# EAGLE design Smedby Charger prot (EAGLE 6.5.0)
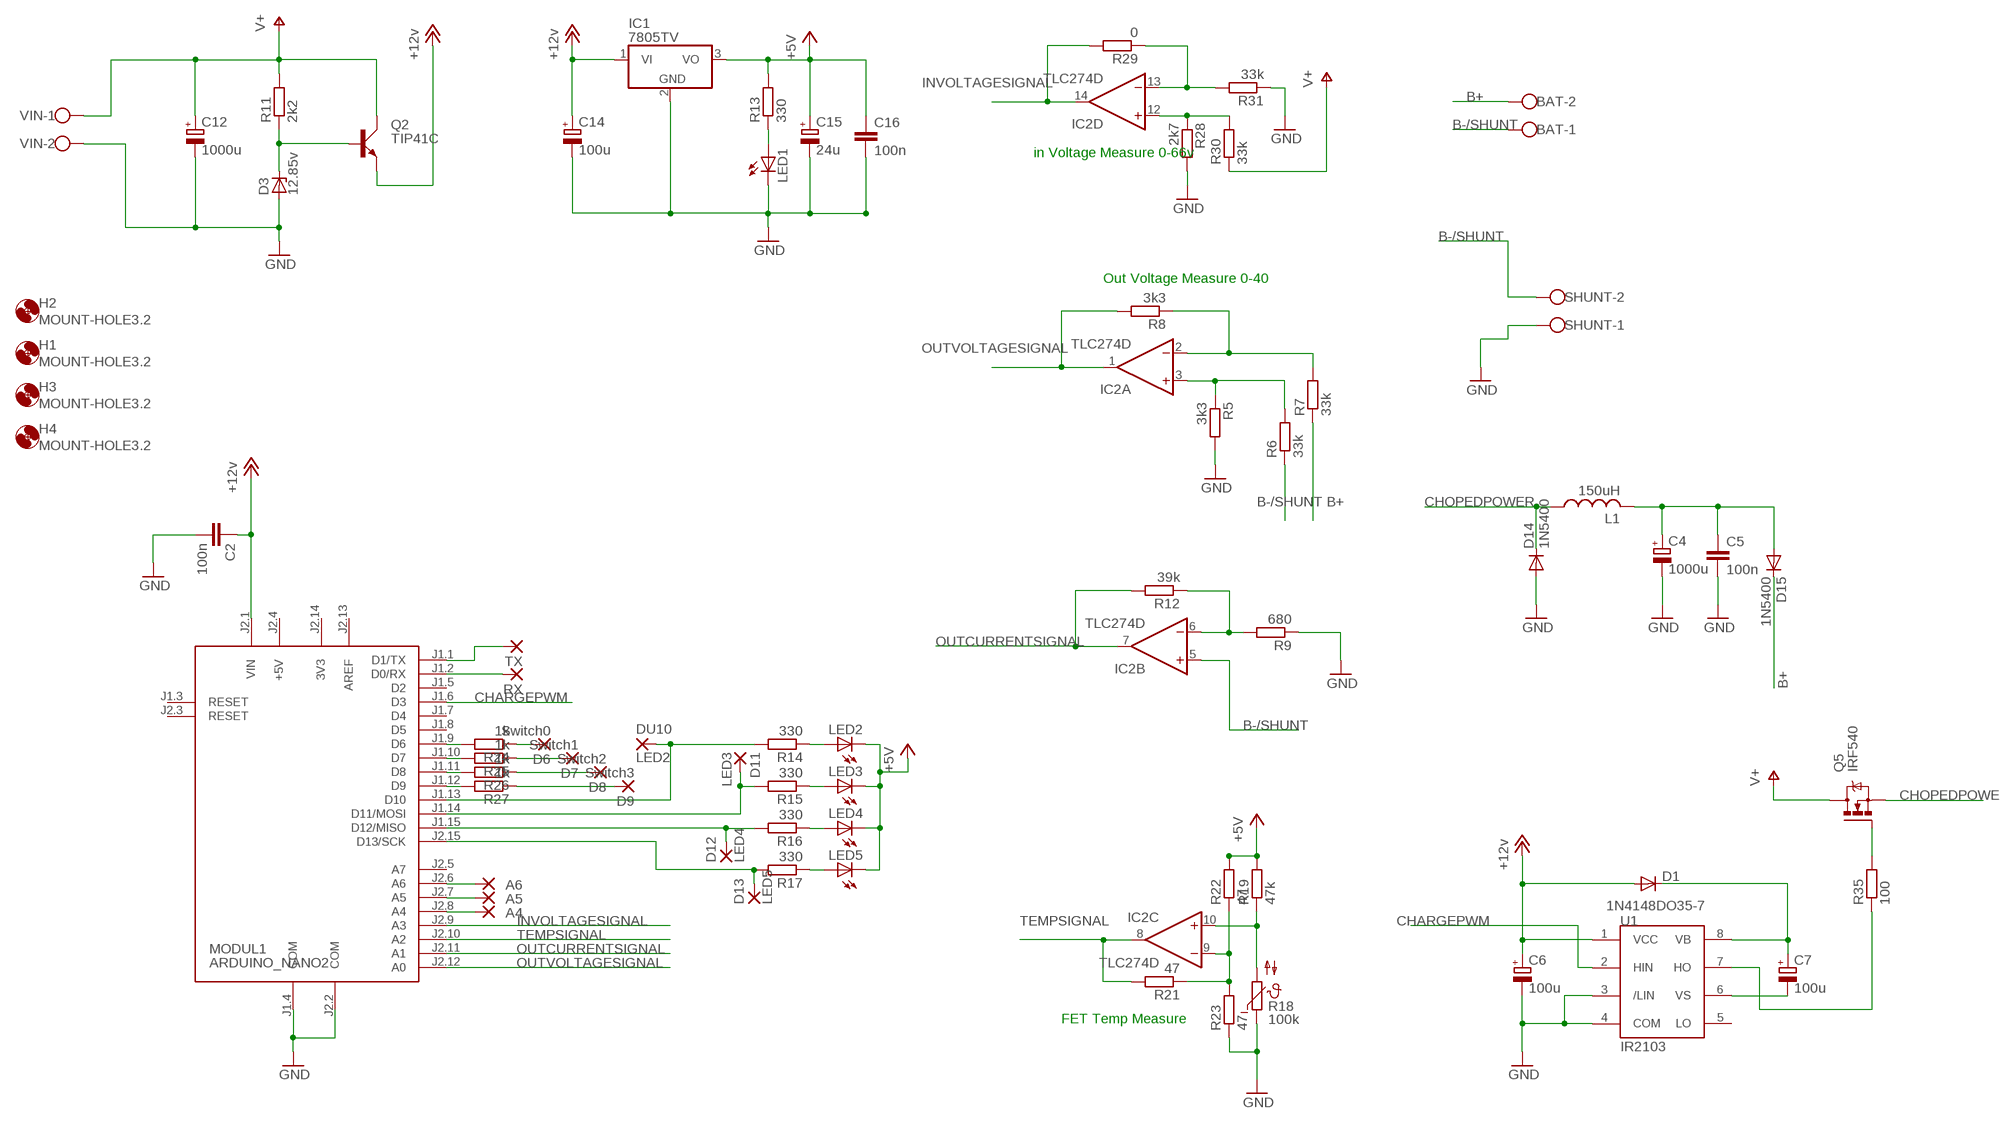
[diagram p0: schematic, sheet 1]

## Parts
A4  1,6/0,9  [1,6/0,9]
A5  1,6/0,9  [1,6/0,9]
A6  1,6/0,9  [1,6/0,9]
BAT  W237-102  [W237-102]
C2  100n  C-EU050-024X044  [C050-024X044]
C4  1000u  CPOL-EUE7.5-18  [E7,5-18]
C5  100n  C-EU050-024X044  [C050-024X044]
C6  100u  CPOL-EUE2.5-5  [E2,5-5]
C7  100u  CPOL-EUE2.5-5  [E2,5-5]
C12  1000u  CPOL-EUE7.5-18  [E7,5-18]
C14  100u  CPOL-EUE2.5-5  [E2,5-5]
C15  24u  CPOL-EUE2.5-5  [E2,5-5]
C16  100n  C-EU050-024X044  [C050-024X044]
D1  1N4148DO35-7  [DO35-7]
D3  12.85v  BZX55  [DO35Z10]
D6  Switch0  1,6/0,9  [1,6/0,9]
D7  Switch1  1,6/0,9  [1,6/0,9]
D8  Switch2  1,6/0,9  [1,6/0,9]
D9  Switch3  1,6/0,9  [1,6/0,9]
D11  LED3  1,6/0,9  [1,6/0,9]
D12  LED4  1,6/0,9  [1,6/0,9]
D13  LED5  1,6/0,9  [1,6/0,9]
D14  1N5400  [DO201-15]
D15  1N5400  [DO201-15]
DU10  LED2  1,6/0,9  [1,6/0,9]
H1  MOUNT-HOLE3.2  [3,2]
H2  MOUNT-HOLE3.2  [3,2]
H3  MOUNT-HOLE3.2  [3,2]
H4  MOUNT-HOLE3.2  [3,2]
IC1  7805TV  [TO220V]
IC2  TLC274D  [SO14]
L1  150uH  L-USTJ4-U1  [TJ4-U1]
LED1  LED3MM  [LED3MM]
LED2  LED3MM  [LED3MM]
LED3  LED3MM  [LED3MM]
LED4  LED3MM  [LED3MM]
LED5  LED3MM  [LED3MM]
MODUL1  ARDUINO_NANO2  [ARDUINO_NANO2]
Q2  TIP41C  [TO220AV]
Q5  IRF540  [TO220BV]
R5  3k3  R-EU_0207/2V  [0207/2V]
R6  33k  R-EU_0207/2V  [0207/2V]
R7  33k  R-EU_0207/2V  [0207/2V]
R8  3k3  R-EU_0207/2V  [0207/2V]
R9  680  R-EU_0207/2V  [0207/2V]
R11  2k2  R-EU_0617/5V  [0617V]
R12  39k  R-EU_0207/2V  [0207/2V]
R13  330  R-EU_0207/2V  [0207/2V]
R14  330  R-EU_0207/2V  [0207/2V]
R15  330  R-EU_0207/2V  [0207/2V]
R16  330  R-EU_0207/2V  [0207/2V]
R17  330  R-EU_0207/2V  [0207/2V]
R18  100k  NTC640-9  [N640]
R19  47k  R-EU_0207/2V  [0207/2V]
R21  47  R-EU_0207/2V  [0207/2V]
R22  47  R-EU_0207/2V  [0207/2V]
R23  47  R-EU_0207/2V  [0207/2V]
R24  1k  R-EU_0207/2V  [0207/2V]
R25  1k  R-EU_0207/2V  [0207/2V]
R26  1k  R-EU_0207/2V  [0207/2V]
R27  1k  R-EU_0207/2V  [0207/2V]
R28  2k7  R-EU_0207/2V  [0207/2V]
R29  0  R-EU_0207/2V  [0207/2V]
R30  33k  R-EU_0207/2V  [0207/2V]
R31  33k  R-EU_0207/2V  [0207/2V]
R35  100  R-EU_0207/2V  [0207/2V]
RX  1,6/0,9  [1,6/0,9]
SHUNT  W237-102  [W237-102]
TX  1,6/0,9  [1,6/0,9]
U1  IR2103  [DIL08]
VIN  W237-102  [W237-102]

## Nets
+5V [Power]: C15.+ C16.1 IC1.3(VO) LED2.K(C) LED3.K(C) LED4.K(C) LED5.K(C) R13.2 R19.2 R22.2
+12V [Power]: C2.1 C6.+ C14.+ D1.A IC1.1(VI) MODUL1.J2.1(VIN) Q2.E U1.1(VCC) ; supply symbol labelled +12v
B+ [HighPower]: BAT.2 D15.C R7.1
B-/SHUNT [HighPower]: BAT.1 IC2.5(B:+IN) R6.1 SHUNT.2
CHARGEPWM: MODUL1.J1.6(D3) U1.2(HIN)
CHOPEDPOWER [HighPower]: D14.C L1.1 Q5.S
GND [HighPower]: C2.2 C4.- C5.2 C6.- C12.- C14.- C15.- C16.2 D3.A D14.A IC1.2(GND) LED1.K(C) MODUL1.J1.4(COM) MODUL1.J2.2(COM) R5.2 R9.1 R18.1 R23.1 R28.2 R31.1 SHUNT.1 U1.3(/LIN) U1.4(COM) VIN.2
INVOLTAGESIGNAL: IC2.14(D:OUT) MODUL1.J2.9(A3) R29.2
LED2: DU10.1(P) MODUL1.J1.13(D10) R14.2
LED3: D11.1(P) MODUL1.J1.14(D11/MOSI) R15.2
LED4: D12.1(P) MODUL1.J1.15(D12/MISO) R16.2
LED5: D13.1(P) MODUL1.J2.15(D13/SCK) R17.2
N$1: D3.C Q2.B R11.1
N$2 [Power]: C7.- U1.6(VS)
N$3: IC2.12(D:+IN) R28.1 R30.2
N$4 [Power]: Q5.G R35.2
N$5: A4.1(P) MODUL1.J2.8(A4)
N$6: MODUL1.J1.1(D1/TX) TX.1(P)
N$8: MODUL1.J1.9(D6) R24.2
N$11: IC2.6(B:-IN) R9.2 R12.1
N$12: MODUL1.J1.10(D7) R25.2
N$14: MODUL1.J1.11(D8) R26.2
N$15: MODUL1.J1.12(D9) R27.2
N$16: A5.1(P) MODUL1.J2.7(A5)
N$17: A6.1(P) MODUL1.J2.6(A6)
N$18: MODUL1.J1.2(D0/RX) RX.1(P)
N$20 [Power]: R35.1 U1.7(HO)
N$22 [HighPower]: C4.+ C5.1 D15.A L1.2
N$24: IC2.3(A:+IN) R5.1 R6.2
N$27: IC2.2(A:-IN) R7.2 R8.1
N$29: LED1.A R13.1
N$30: LED2.A R14.1
N$31: LED3.A R15.1
N$34: LED4.A R16.1
N$35: LED5.A R17.1
N$39: IC2.9(C:-IN) R21.1 R22.1 R23.2
N$46: IC2.10(C:+IN) R18.2 R19.1
N$48: IC2.13(D:-IN) R29.1 R31.2
N$54: D6.1(P) R24.1
N$55: D7.1(P) R25.1
N$56: D8.1(P) R26.1
N$57: D9.1(P) R27.1
OUTCURRENTSIGNAL: IC2.7(B:OUT) MODUL1.J2.11(A1) R12.2
OUTVOLTAGESIGNAL: IC2.1(A:OUT) MODUL1.J2.12(A0) R8.2
TEMPSIGNAL: IC2.8(C:OUT) MODUL1.J2.10(A2) R21.2
V+ [HighPower]: C12.+ Q2.C Q5.D R11.2 R30.1 VIN.1
VB [Power]: C7.+ D1.C U1.8(VB)
Unconnected: MODUL1.J1.3(RESET) MODUL1.J1.5(D2) MODUL1.J1.7(D4) MODUL1.J1.8(D5) MODUL1.J2.3(RESET) MODUL1.J2.5(A7) U1.5(LO)

## Notes on the sheet
- in Voltage Measure 0-66v
- Out Voltage Measure 0-40
- FET Temp Measure

## Power pins joined to a net without a drawn wire
3V3: MODUL1.J2.14(3V3)
+5V: MODUL1.J2.4(+5V)
AREF: MODUL1.J2.13(AREF)
V+: IC2.4(P:V+)
V-: IC2.11(P:V-)

## Library data of the parts
A4-A6 D6-D9 D11-D13 DU10 RX TX = wirepad:1,6/0,9: THROUGH-HOLE PAD
BAT SHUNT VIN = con-wago-500:W237-102: WAGO SCREW CLAMP; MPN: 237-102; OC_FARNELL: unknown; OC_NEWARK: 70K9898
C2 C5 C16 = rcl:C-EU: CAPACITOR, European symbol
C4 C6 C7 C12 C14 C15 = rcl:CPOL-EU: POLARIZED CAPACITOR, European symbol
D1 = diode:1N4148: DIODE high speed (Philips)
D3 = diode:BZX55: Z DIODE
D14 D15 = diode:1N5400: DIODE standard rectifier, 3 A, 50 V (Motorola)
H1-H4 = holes:MOUNT-HOLE: MOUNTING HOLE with drill center marker
IC1 = linear:78*: Positive VOLTAGE REGULATOR Source: http://cache.national.com/ds/LM/LM78L05.pdf http://www.fairchildsemi.com/ds/LM/LM7805.pdf
IC2 = linear:TLC274: OP AMP
L1 = rcl:L-US: INDUCTOR, American symbol
LED1-LED5 = led:LED: LED OSRAM: - CHIPLED LG R971, LG N971, LY N971, LG Q971, LY Q971, LO R971, LY R971 LH N974, LH R974 LS Q976, LO Q976, LY Q976 LO Q996 - Hyper CHIPLED LW Q18S LB Q993, LB Q99A, LB R99A - SideLED LS A670, LO A670, LY A670, LG A670, LP A670 LB A673, LV A673, LT A673, LW A673 LH A674 LY A675 LS A676, LA A676, LO A676, LY A676, LW A676 LS A679, LY A679, LG A679 - Hyper Micro SIDELED® LS Y876, LA Y876, LO Y876, LY Y876 LT Y87S - SmartLED LW L88C, LW L88S LB L89C, LB L89S, LG L890 LS L89K, LO L89K, LY L89K LS L896, LA L896, LO L896, LY L896 - TOPLED LS T670, LO T670, LY T670, LG T670, LP T670 LSG T670, LSP T670, LSY T670, LOP T670, LYG T670 LG T671, LOG T671, LSG T671 LB T673, LV T673, LT T673, LW T673 LH T674 LS T676, LA T676, LO T676, LY T676, LB T676, LH T676, LSB T676, LW T676 LB T67C, LV T67C, LT T67C, LS T67K, LO T67K, LY T67K, LW E67C LS E67B, LA E67B, LO E67B, LY E67B, LB E67C, LV E67C, LT E67C LW T67C LS T679, LY T679, LG T679 LS T770, LO T770, LY T770, LG T770, LP T770 LB T773, LV T773, LT T773, LW T773 LH T774 LS E675, LA E675, LY E675, LS T675 LS T776, LA T776, LO T776, LY T776, LB T776 LHGB T686 LT T68C, LB T68C - Hyper Mini TOPLED® LB M676 - Mini TOPLED Santana® LG M470 LS M47K, LO M47K, LY M47K Source: http://www.osram.convergy.de LUXEON: - LUMILED® LXK2-PW12-R00, LXK2-PW12-S00, LXK2-PW14-U00, LXK2-PW14-V00 LXK2-PM12-R00, LXK2-PM12-S00, LXK2-PM14-U00 LXK2-PE12-Q00, LXK2-PE12-R00, LXK2-PE12-S00, LXK2-PE14-T00, LXK2-PE14-U00 LXK2-PB12-K00, LXK2-PB12-L00, LXK2-PB12-M00, LXK2-PB14-N00, LXK2-PB14-P00, LXK2-PB14-Q00 LXK2-PR12-L00, LXK2-PR12-M00, LXK2-PR14-Q00, LXK2-PR14-R00 LXK2-PD12-Q00, LXK2-PD12-R00, LXK2-PD12-S00 LXK2-PH12-R00, LXK2-PH12-S00 LXK2-PL12-P00, LXK2-PL12-Q00, LXK2-PL12-R00 Source: www.luxeon.com KINGBRIGHT: KA-3528ASYC Source: www.kingbright.com
MODUL1 = arduino:ARDUINO_NANO2: Arduino Nano2 Auto generated by modulcreator.ulp \;; ANZAHL: 2; MODUL: TRUE; STECKX0: -76200; STECKX1: 76200; STECKY0: 177800; STECKY1: 177800
Q2 = transistor-power:TIP41C: NPN TRANSISTOR
Q5 = transistor-power:IRF540: HEXFET Power MOSFET
R5-R9 R12-R17 R19 R21-R31 R35 = rcl:R-EU_: RESISTOR, European symbol
R11 = resistor:R-EU_: RESISTOR, European symbol
R18 = ptc-ntc:NTC640-9: PHILIPS NTC
U1 = irf-2:IR2103: High and low side driver

## Net classes
1 Power: width 0.5 mm
2 HighPower: width 1 mm

## Board
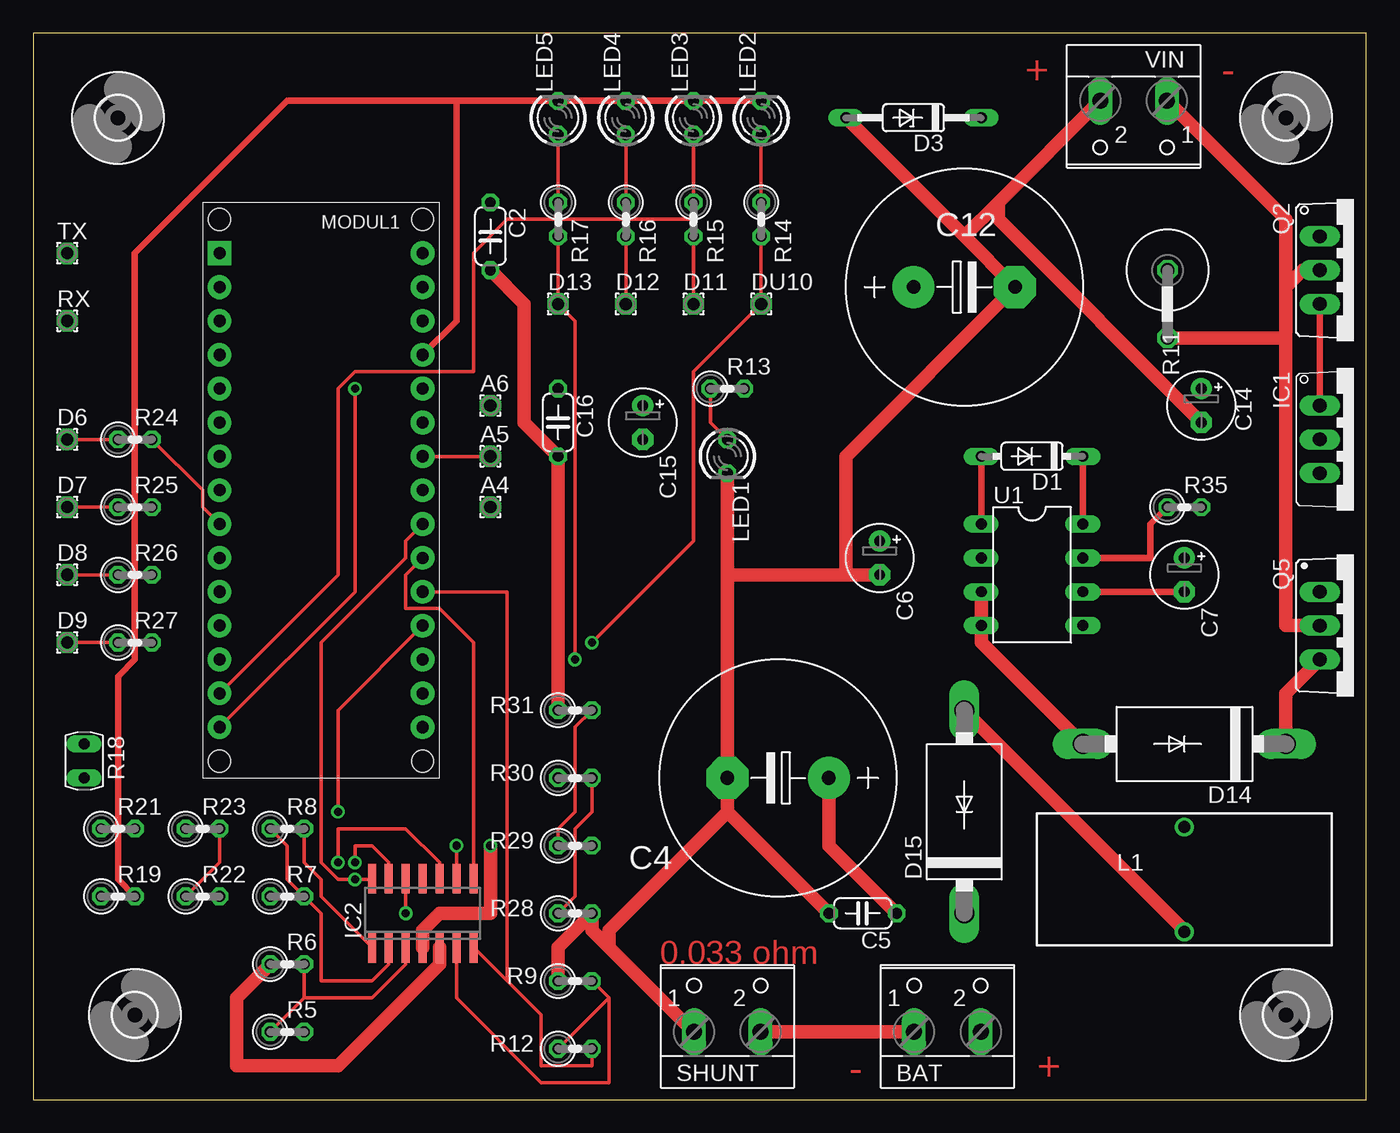
[diagram p1: board, top side]
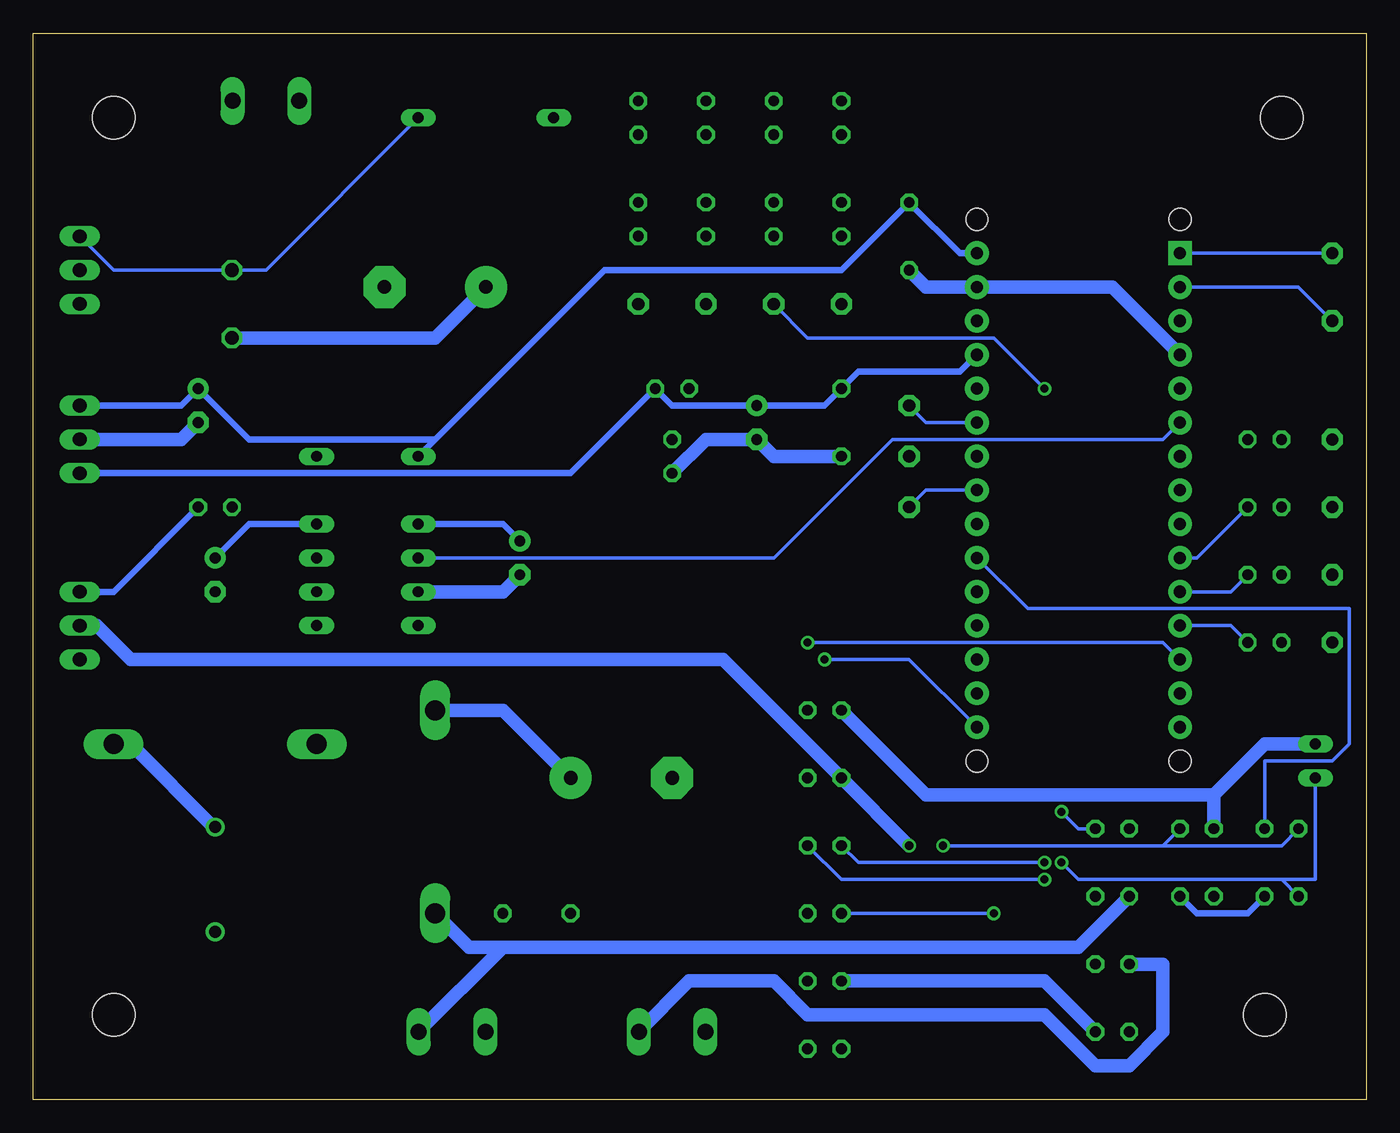
[diagram p2: board, bottom side, seen from below]

Size 100 x 80 mm. Coordinates in mm from the lower left corner, seen from the top.
Outline: 0,0 100,0 100,80 0,80 0,0
Copper layers (1*16): Top 0.035mm / dielectric 1.5mm / Bottom 0.035mm
Design rules "default": minimum track width 10mil, minimum drill 24mil, track to track 10mil, track to pad 10mil, pad to pad 10mil, via to via 10mil, smd to smd 10mil, copper to edge 40mil, drill to drill 10mil, minimum pad ring 10mil, minimum via ring 8mil, stop-mask expansion 0mil, vias tented up to drill 0mil, thermal gap 10mil

### Footprints (pad centres in the part's own frame; a part is rotated, then mirrored left to right if it is on the bottom)
1,6/0,9 = drill 0.914 pad 1.6 octagon: 1 0,0
W237-102 = drill 1.194 long: 1 -2.5,-1.27; 2 2.5,-1.27
C050-024X044 = drill 0.813 octagon: 1 -2.54,0; 2 2.54,0
E7,5-18 = drill 1.016 pad 3.15: + -3.81,0 | drill 1.016 pad 3.15 octagon: - 3.81,0
E2,5-5 = drill 0.813 pad 1.6: + -1.27,0 | drill 0.813 pad 1.6 octagon: - 1.27,0
DO35-7 = drill 0.813 long: A 3.81,0; C -3.81,0
DO35Z10 = drill 0.813 long: A 5.08,0; C -5.08,0
DO201-15 = drill 1.499 long: A 7.62,0; C -7.62,0
3,2 = hole 3.2: 0,0
TO220V = drill 1.016 long: 1 -2.54,-2.54; 2 0,-2.54; 3 2.54,-2.54
SO14 = smd 0.6 x 2.2: 1 -3.81,-2.6; 2 -2.54,-2.6; 3 -1.27,-2.6; 4 0,-2.6; 5 1.27,-2.6; 6 2.54,-2.6; 7 3.81,-2.6; 8 3.81,2.6; 9 2.54,2.6; 10 1.27,2.6; 11 0,2.6; 12 -1.27,2.6; 13 -2.54,2.6; 14 -3.81,2.6
TJ4-U1 = drill 0.9: 1 -3.935,0; 2 3.935,0
LED3MM = drill 0.813 octagon: A -1.27,0; K 1.27,0
ARDUINO_NANO2 = drill 0.914 pad 1.778 square: J1.1 -7.62,17.78 | drill 0.914 pad 1.778: J1.2 -7.62,15.24; J1.3 -7.62,12.7; J1.4 -7.62,10.16; J1.5 -7.62,7.62; J1.6 -7.62,5.08; J1.7 -7.62,2.54; J1.8 -7.62,0; J1.9 -7.62,-2.54; J1.10 -7.62,-5.08; J1.11 -7.62,-7.62; J1.12 -7.62,-10.16; J1.13 -7.62,-12.7; J1.14 -7.62,-15.24; J1.15 -7.62,-17.78; J2.1 7.62,17.78; J2.2 7.62,15.24; J2.3 7.62,12.7; J2.4 7.62,10.16; J2.5 7.62,7.62; J2.6 7.62,5.08; J2.7 7.62,2.54; J2.8 7.62,0; J2.9 7.62,-2.54; J2.10 7.62,-5.08; J2.11 7.62,-7.62; J2.12 7.62,-10.16; J2.13 7.62,-12.7; J2.14 7.62,-15.24; J2.15 7.62,-17.78 | hole 1.651: -7.62,-20.32; 7.62,-20.32; 7.62,20.32; -7.62,20.32
TO220AV = drill 1.016 long: B -2.54,-2.54; C 0,-2.54; E 2.54,-2.54
TO220BV = drill 1.016 long: D 0,-2.54; G -2.54,-2.54; S 2.54,-2.54
0207/2V = drill 0.813 octagon: 1 -1.27,0; 2 1.27,0
0617V = drill 1.016 octagon: 1 -2.54,0; 2 2.54,0
N640 = drill 0.813 long: 1 -1.27,0; 2 1.27,0
DIL08 = drill 0.813 long: 1 -3.81,-3.81; 2 -1.27,-3.81; 3 1.27,-3.81; 4 3.81,-3.81; 5 3.81,3.81; 6 1.27,3.81; 7 -1.27,3.81; 8 -3.81,3.81

### Placement (x,y rotation side)
A4  34.29,44.45 0 top
A5  34.29,48.26 0 top
A6  34.29,52.07 0 top
BAT  68.58,6.35 0 top
C2  34.29,64.77 270 top
C4  55.88,24.13 180 top
C5  62.23,13.97 180 top
C6  63.5,40.64 270 top
C7  86.36,39.37 270 top
C12  69.85,60.96 0 top
C14  87.63,52.07 270 top
C15  45.72,50.8 270 top
C16  39.37,50.8 270 top
D1  74.93,48.26 180 top
D3  66.04,73.66 180 top
D6  2.54,49.53 0 top
D7  2.54,44.45 0 top
D8  2.54,39.37 0 top
D9  2.54,34.29 0 top
D11  49.53,59.69 0 top
D12  44.45,59.69 0 top
D13  39.37,59.69 0 top
D14  86.36,26.67 180 top
D15  69.85,21.59 90 top
DU10  54.61,59.69 0 top
H1  6.35,73.66 0 top
H2  93.98,73.66 0 top
H3  93.98,6.35 0 top
H4  7.62,6.35 0 top
IC1  99.06,49.53 270 top
IC2  29.21,13.97 0 top
L1  86.36,16.51 270 top
LED1  52.07,48.26 270 top
LED2  54.61,73.66 90 top
LED3  49.53,73.66 90 top
LED4  44.45,73.66 90 top
LED5  39.37,73.66 90 top
MODUL1  21.59,45.72 0 top
Q2  99.06,62.23 270 top
Q5  99.06,35.56 270 top
R5  19.05,5.08 0 top
R6  19.05,10.16 0 top
R7  19.05,15.24 0 top
R8  19.05,20.32 0 top
R9  40.64,8.89 0 top
R11  85.09,59.69 270 top
R12  40.64,3.81 0 top
R13  52.07,53.34 0 top
R14  54.61,66.04 270 top
R15  49.53,66.04 270 top
R16  44.45,66.04 270 top
R17  39.37,66.04 270 top
R18  3.81,25.4 270 top
R19  6.35,15.24 0 top
R21  6.35,20.32 0 top
R22  12.7,15.24 0 top
R23  12.7,20.32 0 top
R24  7.62,49.53 0 top
R25  7.62,44.45 0 top
R26  7.62,39.37 0 top
R27  7.62,34.29 0 top
R28  40.64,13.97 0 top
R29  40.64,19.05 0 top
R30  40.64,24.13 0 top
R31  40.64,29.21 0 top
R35  86.36,44.45 0 top
RX  2.54,58.42 0 top
SHUNT  52.07,6.35 0 top
TX  2.54,63.5 0 top
U1  74.93,39.37 270 top
VIN  82.55,73.66 180 top

### Tracks (layer width: path | path; a pad name or v marks a point on that pad's centre or on a via)
+5V
  Top 0.5: LED2.K LED3.K LED4.K LED5.K 31.75,74.93 | R19.2 6.35,16.51 6.35,31.75 7.62,33.02 7.62,63.5 19.05,74.93 31.75,74.93 | MODUL1.J2.4 31.75,58.42 31.75,74.93
  Bottom 0.5: IC1.3 59.69,46.99 R13.2 52.07,52.07 C15.+ 40.64,52.07 C16.1 38.1,54.61 30.48,54.61 MODUL1.J2.4 | R19.2 8.89,13.97 12.7,13.97 R22.2
+12V
  Top 0.5: Q2.E IC1.1 | D1.A U1.1
  Bottom 0.5: IC1.1 88.9,52.07 C14.+ 83.82,49.53 69.85,49.53 | MODUL1.J2.1 30.48,63.5 C2.1 39.37,62.23 57.15,62.23 69.85,49.53 | C6.+ 64.77,43.18 U1.1 | D1.A 69.85,49.53
B+
  Bottom 1: R7.1 21.59,11.43 64.77,11.43 | 64.77,11.43 67.31,11.43 D15.C | 64.77,11.43 71.12,5.08 BAT.2
B-/SHUNT
  Top 1: BAT.1 SHUNT.2 | R6.1 15.24,7.62 15.24,2.54 22.86,2.54 30.48,10.16 IC2.5 30.48,11.43
  Bottom 1: R6.1 15.24,10.16 15.24,5.08 17.78,2.54 20.32,2.54 24.13,6.35 41.91,6.35 44.45,8.89 50.8,8.89 54.61,5.08 SHUNT.2
CHARGEPWM
  Bottom 0.254: U1.2 44.45,40.64 35.56,49.53 15.24,49.53 MODUL1.J1.6
CHOPEDPOWER
  Top 1: Q5.S 93.98,30.48 D14.C
  Bottom 1: D14.C 92.71,26.67 86.36,20.32 L1.1
GND
  Top 1: 69.85,64.77 C12.- 60.96,48.26 60.96,39.37 | 69.85,64.77 D3.A | 69.85,64.77 72.39,67.31 | 72.39,67.31 80.01,74.93 VIN.2 | C14.- 72.39,66.04 72.39,67.31 | 52.07,21.59 C5.2 | 52.07,21.59 C4.- 52.07,39.37 | R9.1 39.37,11.43 R28.2 41.91,12.7 43.18,11.43 | 43.18,11.43 49.53,5.08 SHUNT.1 | 52.07,21.59 43.18,12.7 43.18,11.43 | U1.3 U1.4 71.12,34.29 D14.A | R31.1 C16.2 36.83,50.8 36.83,59.69 C2.2 | 52.07,39.37 60.96,39.37 | 60.96,39.37 C6.- | LED1.K 52.07,39.37
  Bottom 1: IC1.2 88.9,49.53 C14.- | R5.2 24.13,8.89 R9.1 | C6.- 64.77,38.1 U1.3 | C2.2 33.02,60.96 MODUL1.J2.2 19.05,60.96 MODUL1.J1.4 | R18.1 7.62,26.67 11.43,22.86 | R23.1 11.43,22.86 | LED1.K 49.53,49.53 C15.- 44.45,48.26 C16.2 | 11.43,22.86 33.02,22.86 R31.1
INVOLTAGESIGNAL  (via drill 0.61)
  Top 0.254: MODUL1.J2.9 27.94,41.91 27.94,40.64 21.59,34.29 21.59,17.78 22.86,16.51 v24.13,16.51 25.4,16.51 IC2.14
  Bottom 0.254: R29.2 39.37,16.51 v24.13,16.51
LED2  (via drill 0.61)
  Top 0.254: R14.2 DU10.1 49.53,54.61 49.53,41.91 v41.91,34.29
  Bottom 0.254: MODUL1.J1.13 15.24,34.29 v41.91,34.29
LED3
  Top 0.254: D11.1 R15.2 49.53,66.04 35.56,66.04 33.02,63.5 33.02,54.61 24.13,54.61 22.86,53.34 22.86,39.37 MODUL1.J1.14
LED4  (via drill 0.61)
  Top 0.254: D12.1 R16.2 | MODUL1.J1.15 24.13,38.1 v24.13,53.34
  Bottom 0.254: v24.13,53.34 27.94,57.15 41.91,57.15 D12.1
LED5  (via drill 0.61)
  Top 0.254: R17.2 D13.1 40.64,58.42 v40.64,33.02
  Bottom 0.254: MODUL1.J2.15 34.29,33.02 v40.64,33.02
N$1
  Bottom 0.254: D3.C 82.55,62.23 R11.1 93.98,62.23 Q2.B
N$2
  Top 0.5: C7.- U1.6
N$3  (via drill 0.61)
  Top 0.254: v27.94,13.97 IC2.12 | R30.2 41.91,21.59 40.64,20.32 40.64,15.24 R28.1
  Bottom 0.254: R28.1 v27.94,13.97
N$4
  Bottom 0.5: R35.2 93.98,38.1 Q5.G
N$5
  Bottom 0.254: A4.1 33.02,45.72 MODUL1.J2.8
N$6
  Bottom 0.254: MODUL1.J1.1 TX.1
N$8
  Top 0.254: R24.2 12.7,45.72 12.7,44.45 MODUL1.J1.9
N$11
  Top 0.254: 43.18,7.62 43.18,1.27 38.1,1.27 31.75,7.62 IC2.6 31.75,11.43 | R9.2 43.18,7.62 | 43.18,7.62 R12.1
N$12
  Bottom 0.254: R25.2 12.7,40.64 MODUL1.J1.10
N$14
  Bottom 0.254: R26.2 10.16,38.1 MODUL1.J1.11
N$15
  Bottom 0.254: R27.2 10.16,35.56 MODUL1.J1.12
N$16
  Top 0.254: MODUL1.J2.7 A5.1
N$17
  Bottom 0.254: A6.1 33.02,50.8 MODUL1.J2.6
N$18
  Bottom 0.254: RX.1 5.08,60.96 MODUL1.J1.2
N$20
  Top 0.5: U1.7 83.82,40.64 83.82,43.18 R35.1
N$22
  Top 1: C5.1 59.69,19.05 C4.+ | D15.A 86.36,12.7 L1.2
  Bottom 1: C4.+ 64.77,29.21 D15.A
N$24
  Top 0.254: 20.32,7.62 25.4,7.62 27.94,10.16 IC2.3 27.94,11.43 | R6.2 20.32,7.62 | 20.32,7.62 R5.1
N$27
  Top 0.254: 26.67,11.43 IC2.2 26.67,10.16 25.4,8.89 21.59,8.89 21.59,13.97 R7.2 19.05,16.51 19.05,19.05 R8.1
N$29
  Top 0.254: LED1.A 50.8,50.8 R13.1
N$30
  Top 0.254: LED2.A R14.1
N$31
  Top 0.254: LED3.A R15.1
N$34
  Top 0.254: LED4.A R16.1
N$35
  Top 0.254: LED5.A R17.1
N$39  (via drill 0.61)
  Top 0.254: v31.75,19.05 IC2.9 31.75,16.51 | R22.1 13.97,17.78 R23.2
  Bottom 0.254: 15.24,19.05 v31.75,19.05 | R23.2 15.24,19.05 | R21.1 6.35,19.05 15.24,19.05
N$46  (via drill 0.61)
  Top 0.254: v22.86,17.78 22.86,20.32 27.94,20.32 30.48,17.78 IC2.10 30.48,16.51
  Bottom 0.254: v22.86,17.78 21.59,16.51 6.35,16.51 | R19.1 6.35,16.51 | R18.2 3.81,16.51 6.35,16.51
N$48  (via drill 0.61)
  Top 0.254: v24.13,17.78 24.13,19.05 25.4,19.05 26.67,17.78 IC2.13 26.67,16.51 | R31.2 40.64,27.94 40.64,21.59 39.37,20.32 R29.1
  Bottom 0.254: v24.13,17.78 38.1,17.78 R29.1
N$54
  Top 0.254: D6.1 R24.1
N$55
  Top 0.254: D7.1 R25.1
N$56
  Top 0.254: D8.1 R26.1
N$57
  Top 0.254: D9.1 R27.1
OUTCURRENTSIGNAL
  Top 0.254: 35.56,8.89 38.1,6.35 38.1,2.54 41.91,2.54 R12.2 | 35.56,8.89 33.02,11.43 IC2.7 | MODUL1.J2.11 35.56,38.1 35.56,8.89
OUTVOLTAGESIGNAL  (via drill 0.61)
  Top 0.254: R8.2 20.32,17.78 21.59,16.51 21.59,15.24 25.4,11.43 IC2.1 | MODUL1.J2.12 22.86,29.21 v22.86,21.59
  Bottom 0.254: v22.86,21.59 21.59,20.32 R8.2
TEMPSIGNAL
  Top 0.254: MODUL1.J2.10 27.94,39.37 27.94,36.83 30.48,36.83 33.02,34.29 IC2.8 33.02,16.51
  Bottom 0.254: R21.2 7.62,25.4 2.54,25.4 1.27,26.67 1.27,36.83 25.4,36.83 MODUL1.J2.10
V+  (via drill 0.61)
  Top 1: IC2.4 29.21,12.7 30.48,13.97 34.29,13.97 v34.29,19.05 | Q5.D 93.98,35.56 93.98,57.15 | 93.98,60.96 93.98,57.15 | 93.98,60.96 95.25,62.23 Q2.C | 93.98,57.15 R11.2 | 93.98,60.96 93.98,66.04 85.09,74.93 VIN.1
  Bottom 1: v34.29,19.05 R30.1 48.26,33.02 92.71,33.02 95.25,35.56 Q5.D | C12.+ 69.85,57.15 R11.2
VB
  Top 0.5: D1.C U1.8
  Bottom 0.5: C7.+ 83.82,43.18 U1.8

### Text on the board
Top: + | - | 0.033 ohm | + | -